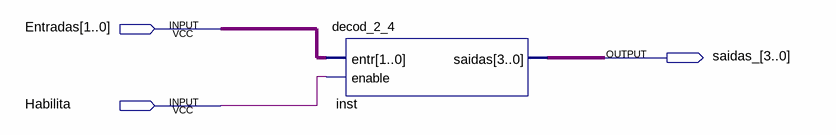
[diagram p0: schematic sheet]
// Quartus schematic proj-decoder.bdf as structural Verilog: 1 symbols, 3 pins
module \proj-decoder  (
  input  [1:0] Entradas,
  input  Habilita,
  output [3:0] saidas_
);

  decod_2_4 inst (.entr(Entradas), .enable(Habilita), .saidas(saidas_));
endmodule
